# EAGLE design clock_schematic (EAGLE 7.7.0)
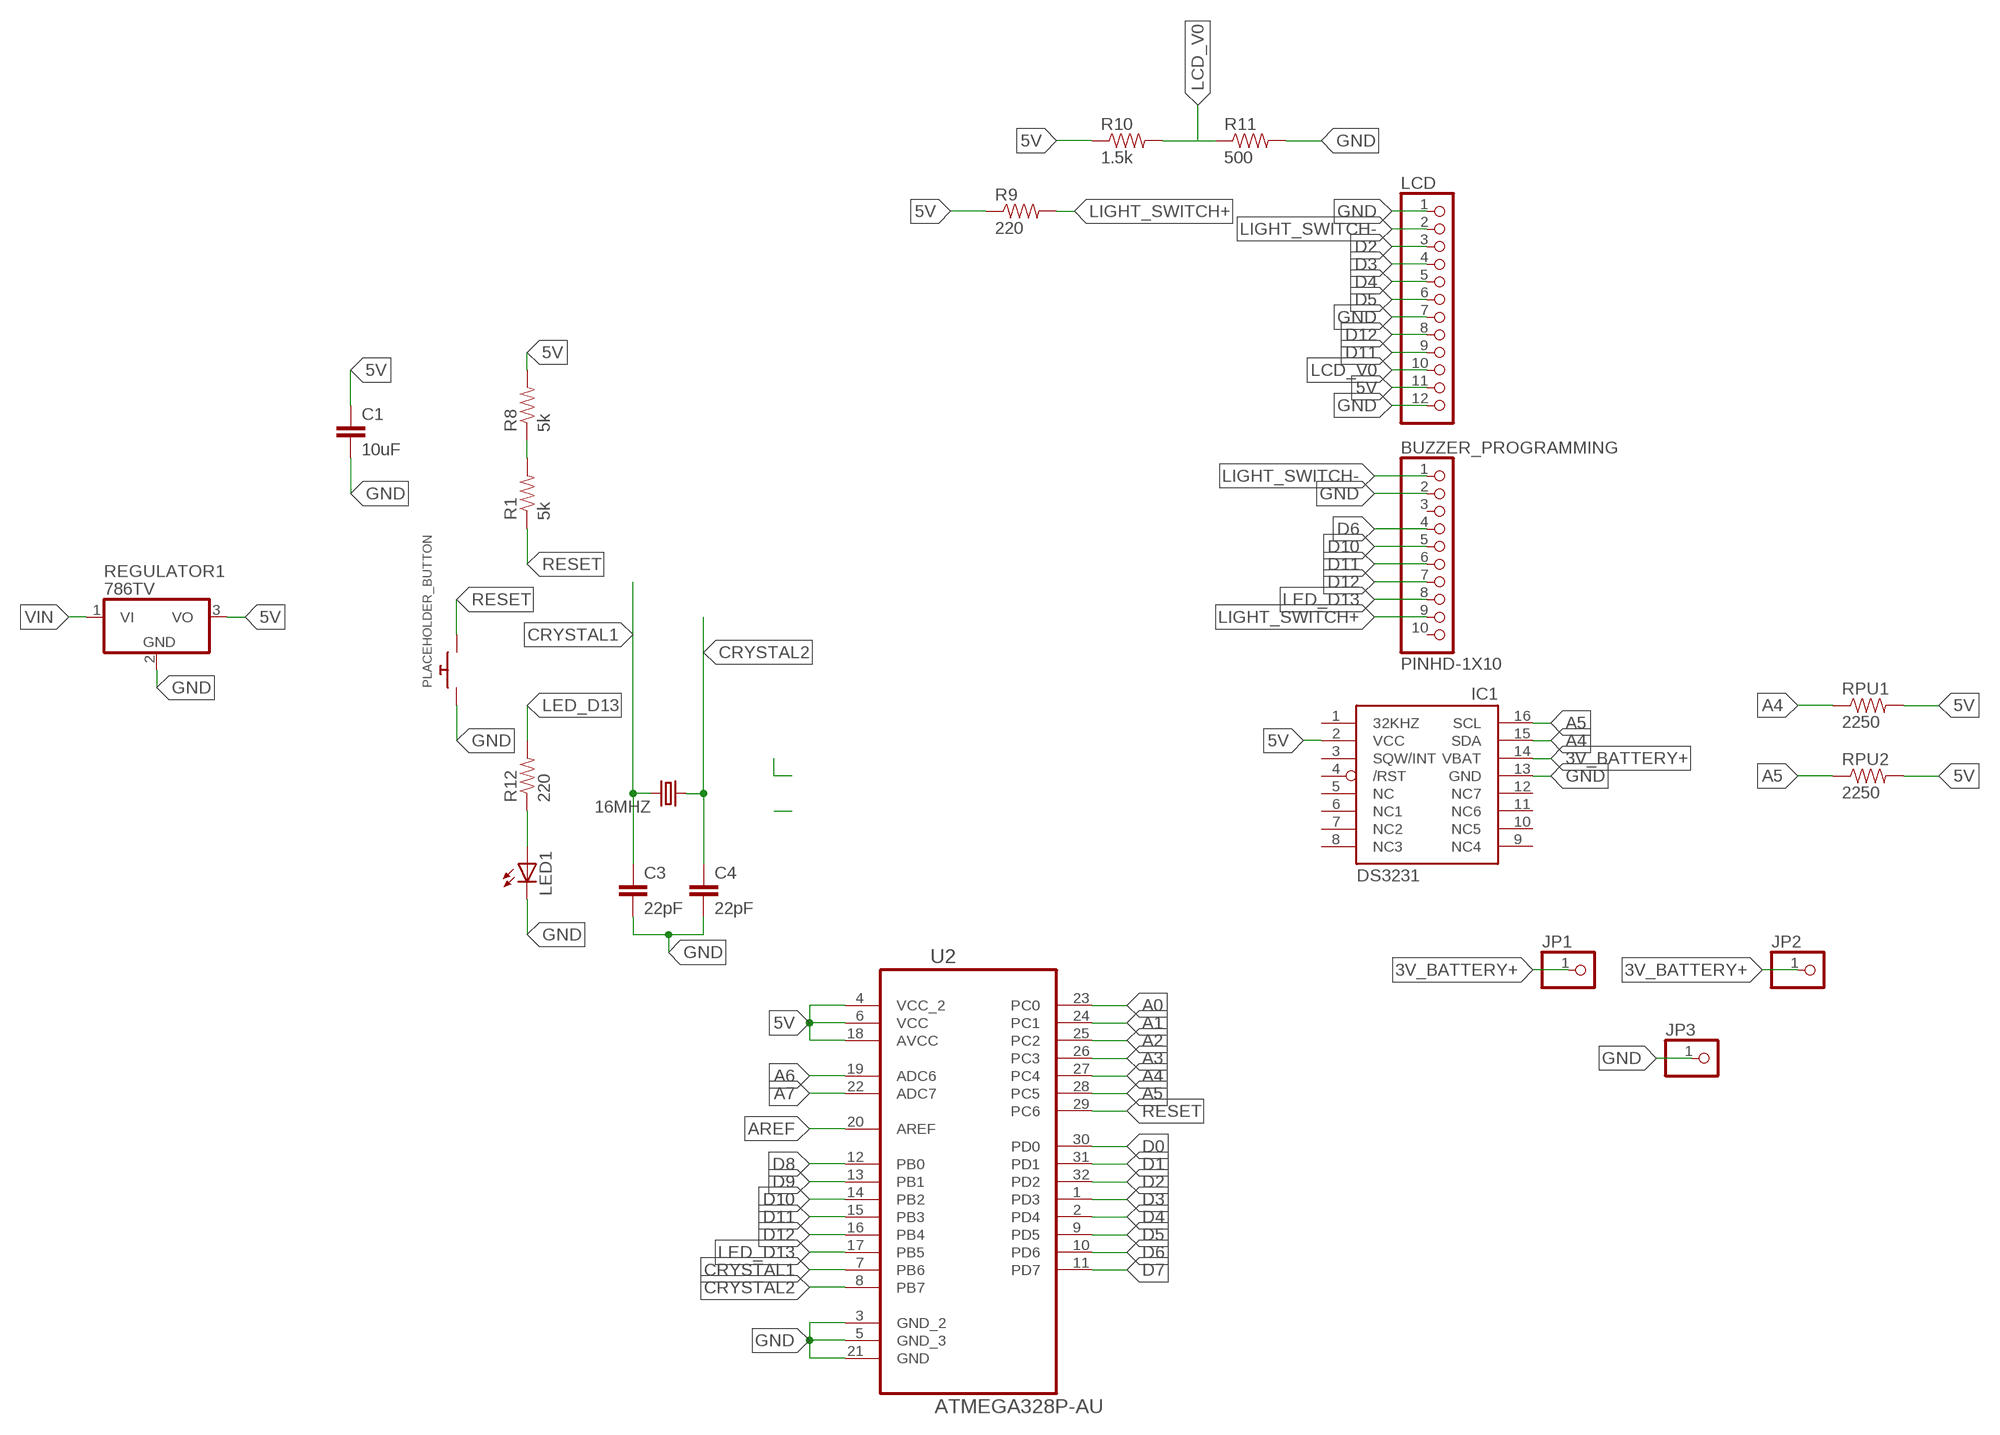
[diagram p0: schematic, sheet 1]

## Parts
16MHZ  CRYSTALHC18U-V  [HC18U-V]
BUZZER_PROGRAMMING  PINHD-1X10  [1X10-BIG]
C1  10uF  CAP0805  [0805]
C3  22pF  CAP0805  [0805]
C4  22pF  CAP0805  [0805]
IC1  DS3231/SO  [SO16W]
JP1  PINHD-1X1  [1X01]
JP2  PINHD-1X1  [1X01]
JP3  PINHD-1X1  [1X01]
LCD  PINHD-1X12  [1X12]
LED1  LEDCHIPLED_0805  [CHIPLED_0805]
PLACEHOLDER_BUTTON  SWITCH_PUSHBUTTONSOFTTOUCHSMD_SJ  [PUSHBUTTON_SMD_SJ]
R1  5k  RESISTOR0805-RES  [0805]
R8  5k  RESISTOR0805-RES  [0805]
R9  220  RESISTOR0805-RES  [0805]
R10  1.5k  RESISTOR0805-RES  [0805]
R11  500  RESISTOR0805-RES  [0805]
R12  220  RESISTOR0805-RES  [0805]
REGULATOR1  786TV  [TO220V]
RPU1  2250  RESISTOR0805-RES  [0805]
RPU2  2250  RESISTOR0805-RES  [0805]
U2  ATMEGA328P-AU  [QFP80P900X900X120-32N]

## Nets
3V_BATTERY+: IC1.14(VBAT) JP1.1 JP2.1
5V: C1.1 IC1.2(VCC) LCD.11 R8.2 R9.1 R10.1 REGULATOR1.3(VO) RPU1.2 RPU2.2 U2.4(VCC_2) U2.6(VCC) U2.18(AVCC)
A0: U2.23(PC0)
A1: U2.24(PC1)
A2: U2.25(PC2)
A3: U2.26(PC3)
A4: IC1.15(SDA) RPU1.1 U2.27(PC4)
A5: IC1.16(SCL) RPU2.1 U2.28(PC5)
A6: U2.19(ADC6)
A7: U2.22(ADC7)
AREF: U2.20(AREF)
CRYSTAL1: 16MHZ.2 C3.1 U2.7(PB6)
CRYSTAL2: 16MHZ.1 C4.1 U2.8(PB7)
D0: U2.30(PD0)
D1: U2.31(PD1)
D2: LCD.3 U2.32(PD2)
D3: LCD.4 U2.1(PD3)
D4: LCD.5 U2.2(PD4)
D5: LCD.6 U2.9(PD5)
D6: BUZZER_PROGRAMMING.4 U2.10(PD6)
D7: U2.11(PD7)
D8: U2.12(PB0)
D9: U2.13(PB1)
D10: BUZZER_PROGRAMMING.5 U2.14(PB2)
D11: BUZZER_PROGRAMMING.6 LCD.9 U2.15(PB3)
D12: BUZZER_PROGRAMMING.7 LCD.8 U2.16(PB4)
GND: BUZZER_PROGRAMMING.2 C1.2 C3.2 C4.2 IC1.13(GND) JP3.1 LCD.1 LCD.7 LCD.12 LED1.C PLACEHOLDER_BUTTON.P$1 R11.2 REGULATOR1.2(GND) U2.3(GND_2) U2.5(GND_3) U2.21(GND)
LCD_V0: LCD.10 R10.2 R11.1
LED_D13: BUZZER_PROGRAMMING.8 R12.2 U2.17(PB5)
LIGHT_SWITCH+: BUZZER_PROGRAMMING.9 R9.2
LIGHT_SWITCH-: BUZZER_PROGRAMMING.1 LCD.2
N$3: R1.2 R8.1
N$4: LED1.A R12.1
RESET: PLACEHOLDER_BUTTON.P$2 R1.1 U2.29(PC6)
VIN: REGULATOR1.1(VI)
Unconnected: BUZZER_PROGRAMMING.3 BUZZER_PROGRAMMING.10 IC1.1(32KHZ) IC1.3(SQW/INT) IC1.4(/RST) IC1.5(NC) IC1.6(NC1) IC1.7(NC2) IC1.8(NC3) IC1.9(NC4) IC1.10(NC5) IC1.11(NC6) IC1.12(NC7)

## Library data of the parts
16MHZ = adafruit:CRYSTAL: CRYSTAL; OC_FARNELL: unknown; OC_NEWARK: unknown
BUZZER_PROGRAMMING = adafruit:PINHD-1X10: Pin header 1x10 0.1" spacing With round pins
C1 C3 C4 = SparkFun-Capacitors:CAP: Capacitor Standard 0603 ceramic capacitor, and 0.1" leaded capacitor.
IC1 = adafruit:DS3231
JP1-JP3 = adafruit:PINHD-1X1: Pin header 1x1 for 0.1" spacing With round pins
LCD = adafruit:PINHD-1X12: PIN HEADER
LED1 = adafruit:LED: LED OSRAM: - CHIPLED LG R971, LG N971, LY N971, LG Q971, LY Q971, LO R971, LY R971 LH N974, LH R974 LS Q976, LO Q976, LY Q976 LO Q996 - Hyper CHIPLED LW Q18S LB Q993, LB Q99A, LB R99A - SideLED LS A670, LO A670, LY A670, LG A670, LP A670 LB A673, LV A673, LT A673, LW A673 LH A674 LY A675 LS A676, LA A676, LO A676, LY A676, LW A676 LS A679, LY A679, LG A679 - Hyper Micro SIDELED® LS Y876, LA Y876, LO Y876, LY Y876 LT Y87S - SmartLED LW L88C, LW L88S LB L89C, LB L89S, LG L890 LS L89K, LO L89K, LY L89K LS L896, LA L896, LO L896, LY L896 - TOPLED LS T670, LO T670, LY T670, LG T670, LP T670 LSG T670, LSP T670, LSY T670, LOP T670, LYG T670 LG T671, LOG T671, LSG T671 LB T673, LV T673, LT T673, LW T673 LH T674 LS T676, LA T676, LO T676, LY T676, LB T676, LH T676, LSB T676, LW T676 LB T67C, LV T67C, LT T67C, LS T67K, LO T67K, LY T67K, LW E67C LS E67B, LA E67B, LO E67B, LY E67B, LB E67C, LV E67C, LT E67C LW T67C LS T679, LY T679, LG T679 LS T770, LO T770, LY T770, LG T770, LP T770 LB T773, LV T773, LT T773, LW T773 LH T774 LS E675, LA E675, LY E675, LS T675 LS T776, LA T776, LO T776, LY T776, LB T776 LHGB T686 LT T68C, LB T68C - Hyper Mini TOPLED® LB M676 - Mini TOPLED Santana® LG M470 LS M47K, LO M47K, LY M47K Source: http://www.osram.convergy.de/
PLACEHOLDER_BUTTON = adafruit:SWITCH_PUSHBUTTON: Buttons SOFTTOUCHSMD_SJ - Soft touch temporary push button (Super Junk Akihabara) Compatible with SKPMANE010 [Mouser: 688-SKPMAN] C&K_KSS = Digikey: KSS221GLFS
R1 R8-R12 RPU1 RPU2 = SparkFun-Resistors:RESISTOR: Resistor Basic schematic elements and footprints for 0603, 1206, and PTH resistors.
REGULATOR1 = linear:78*: Positive VOLTAGE REGULATOR Source: http://cache.national.com/ds/LM/LM78L05.pdf http://www.fairchildsemi.com/ds/LM/LM7805.pdf
U2 = Atmel_By_element14_Batch_1-00:ATMEGA328P-AU: 8-bit Microcontroller with In-System Programmable Flash; MPN: ATMEGA328P-AU; OC_FARNELL: 1715486; OC_NEWARK: 14R4631; PACKAGE: TQFP-32; SUPPLIER: Atmel

## Board
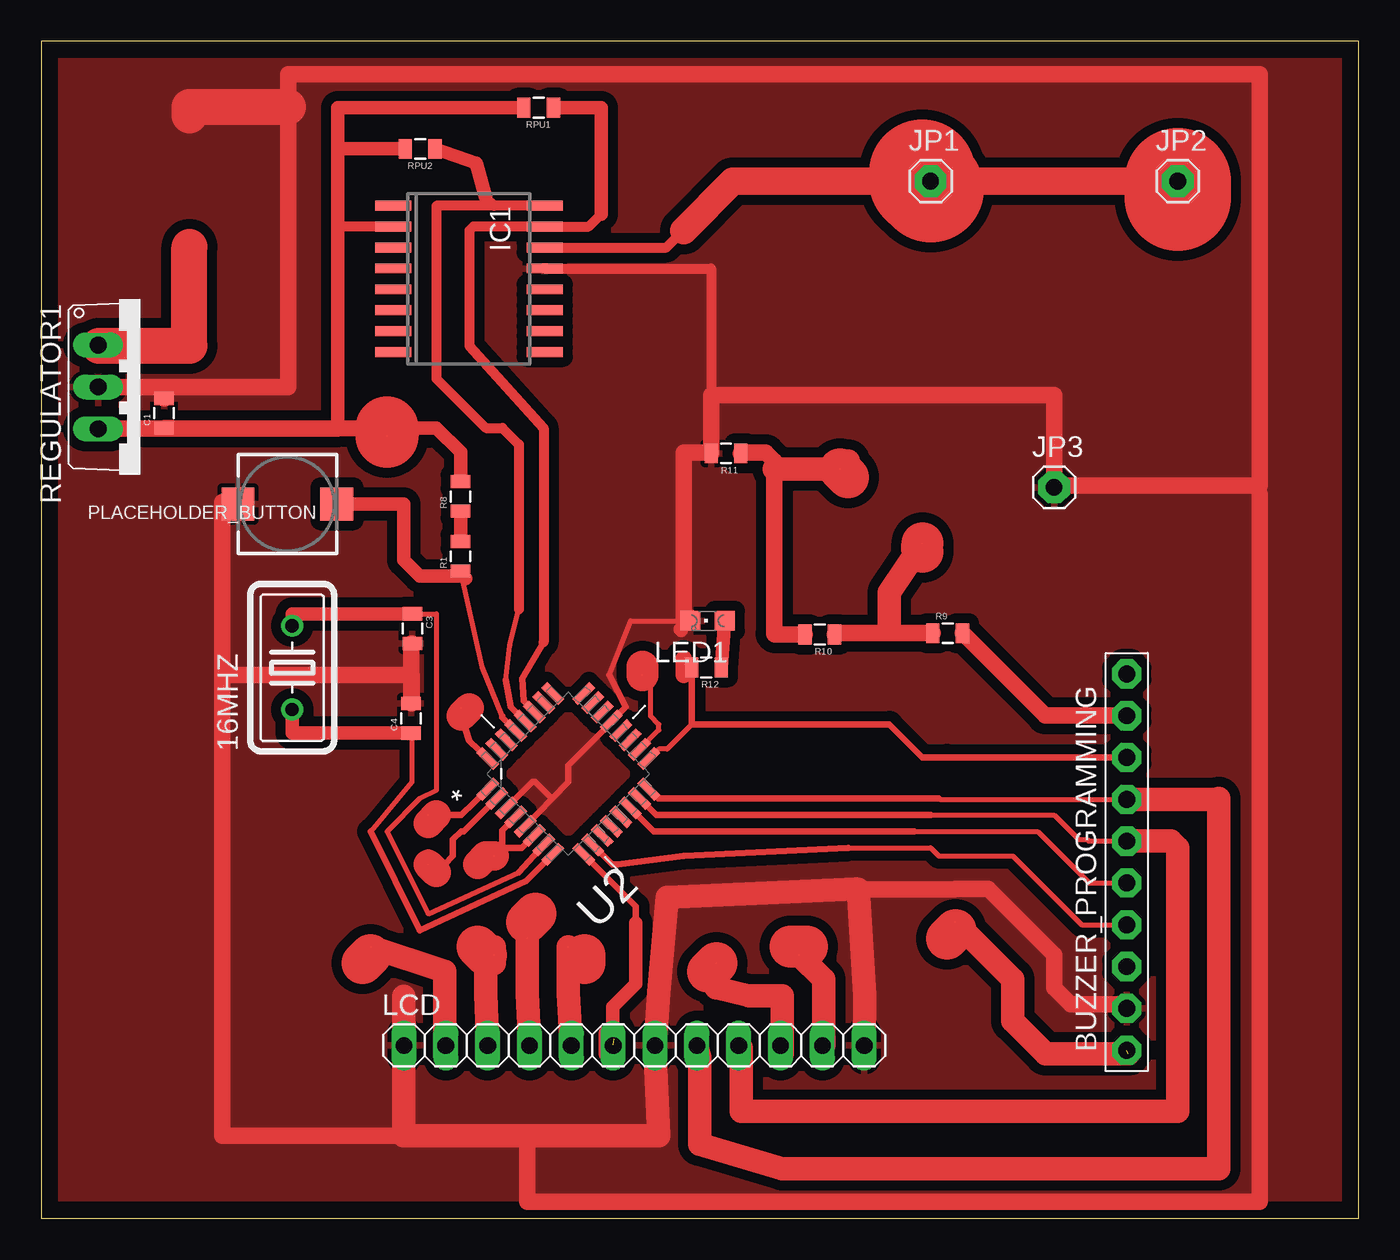
[diagram p1: board, top side]
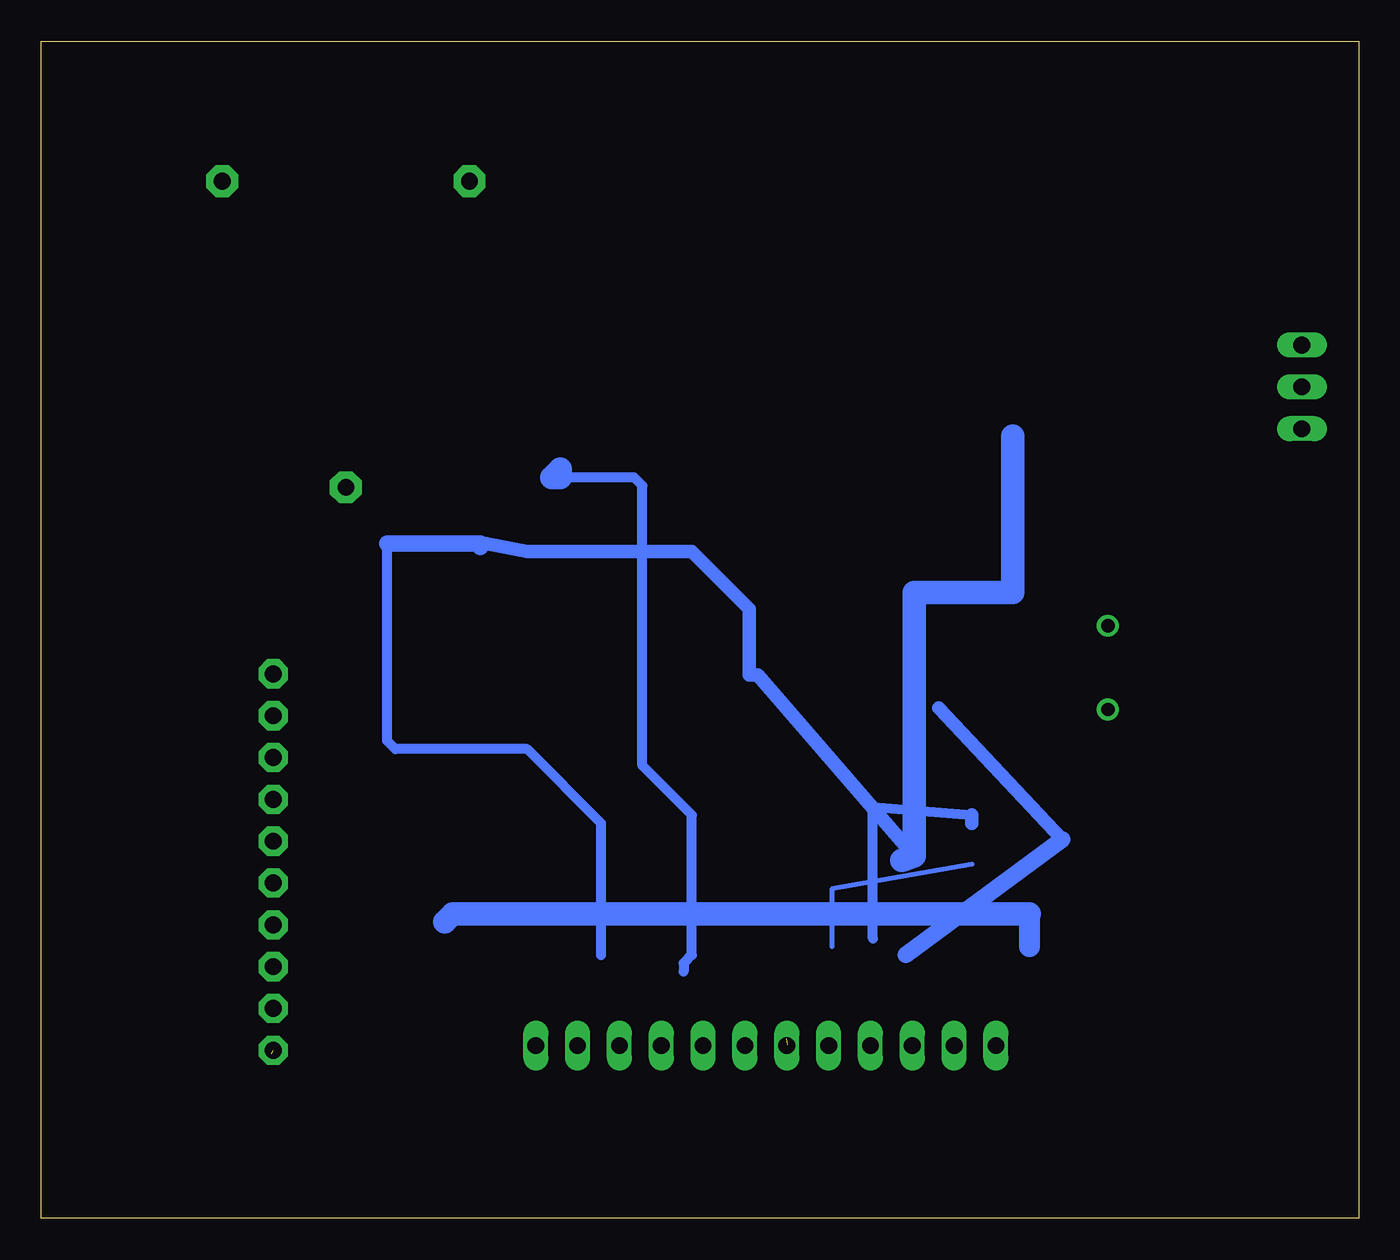
[diagram p2: board, bottom side, seen from below]

Size 80 x 71.5 mm. Coordinates in mm from the lower left corner, seen from the top.
Outline: 0,0 80,0 80,71.5 0,71.5 0,0
Copper layers (1*16): Top 0.035mm / dielectric 1.5mm / Bottom 0.035mm
Design rules "default": minimum track width 10mil, minimum drill 24mil, track to track 8mil, track to pad 8mil, pad to pad 8mil, via to via 8mil, smd to smd 8mil, copper to edge 40mil, drill to drill 8mil, minimum pad ring 10mil, minimum via ring 8mil, stop-mask expansion 4mil, vias tented up to drill 0mil, thermal gap 10mil

### Footprints (pad centres in the part's own frame; a part is rotated, then mirrored left to right if it is on the bottom)
HC18U-V = drill 0.813: 1 -2.54,0; 2 2.54,0
1X10-BIG = drill 1.016 pad 1.778 octagon: 1 -11.43,0; 2 -8.89,0; 3 -6.35,0; 4 -3.81,0; 5 -1.27,0; 6 1.27,0; 7 3.81,0; 8 6.35,0; 9 8.89,0; 10 11.43,0
0805 = smd 0.8 x 1.2: 1 -0.9,0; 2 0.9,0
SO16W = smd 0.6 x 2.2: 1 -4.445,-4.6; 2 -3.175,-4.6; 3 -1.905,-4.6; 4 -0.635,-4.6; 5 0.635,-4.6; 6 1.905,-4.6; 7 3.175,-4.6; 8 4.445,-4.6; 9 4.445,4.6; 10 3.175,4.6; 11 1.905,4.6; 12 0.635,4.6; 13 -0.635,4.6; 14 -1.905,4.6; 15 -3.175,4.6; 16 -4.445,4.6
1X01 = drill 1.016 pad 1.93 octagon: 1 0,0
1X12 = drill 1.016 long: 1 -13.97,0; 2 -11.43,0; 3 -8.89,0; 4 -6.35,0; 5 -3.81,0; 6 -1.27,0; 7 1.27,0; 8 3.81,0; 9 6.35,0; 10 8.89,0; 11 11.43,0; 12 13.97,0
CHIPLED_0805 = smd 1.2 x 1.2: A 0,-1.05; C 0,1.05
PUSHBUTTON_SMD_SJ = smd 2 x 2: P$1 3,0; P$2 -3,0
TO220V = drill 1.016 long: 1 -2.54,-2.54; 2 0,-2.54; 3 2.54,-2.54
QFP80P900X900X120-32N = smd 1.473 x 0.508: 1 -4.115,2.794; 2 -4.115,2.007; 3 -4.115,1.194; 4 -4.115,0.406; 5 -4.115,-0.406; 6 -4.115,-1.194; 7 -4.115,-2.007; 8 -4.115,-2.794; 17 4.115,-2.794; 18 4.115,-2.007; 19 4.115,-1.194; 20 4.115,-0.406; 21 4.115,0.406; 22 4.115,1.194; 23 4.115,2.007; 24 4.115,2.794 | smd 0.508 x 1.473: 9 -2.794,-4.115; 10 -2.007,-4.115; 11 -1.194,-4.115; 12 -0.406,-4.115; 13 0.406,-4.115; 14 1.194,-4.115; 15 2.007,-4.115; 16 2.794,-4.115; 25 2.794,4.115; 26 2.007,4.115; 27 1.194,4.115; 28 0.406,4.115; 29 -0.406,4.115; 30 -1.194,4.115; 31 -2.007,4.115; 32 -2.794,4.115

### Placement (x,y rotation side)
16MHZ  15.24,33.45 90 top
BUZZER_PROGRAMMING  65.91,21.64 90 top
C1  7.46,48.9 90 top
C3  22.54,35.82 270 top
C4  22.46,30.37 90 top
IC1  25.97,57.06 270 top
JP1  54,63 0 top
JP2  69,63 0 top
JP3  61.5,44.4 0 top
LCD  36,10.5 0 top
LED1  40.46,36.29 90 top
PLACEHOLDER_BUTTON  14.95,43.39 180 top
R1  25.46,40.21 90 top
R8  25.46,43.85 90 top
R9  55.04,35.54 0 top
R10  47.27,35.46 180 top
R11  41.58,46.46 180 top
R12  40.39,33.46 180 top
REGULATOR1  6,50.5 270 top
RPU1  30.2,67.46 180 top
RPU2  23.01,64.96 180 top
U2  32,27 45 top

### Tracks (layer width: path | path; a pad name or v marks a point on that pad's centre or on a via)
3V_BATTERY+
  Top 0.61: IC1.14 37.97,58.97 39,60
  Top 1.676: JP2.1 JP1.1 42,63 39,60
  Top 6.452: JP2.1 69,62
5V  (5 unrouted)
  Top 0.305: U2.18 37.5,29.66 37.5,30 37,30.5 37,33 36.5,33
  Top 0.406: 47.5,10.5 LCD.11 | U2.4 28,23.57 28,22.5 | U2.6 29.19,22.5 28,22.5 | 28,22.5 27.5,22 27,21.5
  Top 0.61: IC1.2 18.23,60.23 18,60
  Top 0.813: R8.2 25.46,46.54 24,48 21,48 18,48 18,60 18,64.96 | RPU1.2 18,67.46 18,64.96 | RPU2.2 18,64.96 | 27,21.5 27,22
  Top 1.016: R10.1 48.25,35.54 R9.1 51.96,35.54 51.5,36 | REGULATOR1.3 8,47.96 | 8,47.96 12,47.96 | 12,47.96 21,48 | C1.1 8,48 8,47.96 | 12,47.96 18,47.96 18,48
  Top 1.422: 47.5,10.5 47.5,14.5 46,16 | 53.5,41 51.5,38 51.5,36
  Top 1.778: 27.5,22 27,22 26.5,21.5
  Top 1.93: 36.5,33.5 36.5,33
  Top 2.54: 53.5,40.5 53.5,41
  Top 3.81: 21,48 21,47.5
  Bottom 0.61: 46,16 46,24 50.5,28.5 58.5,28.5 59,29 59,41
  Bottom 0.813: 27,22 36.5,33 37,33 37,37 40.5,40.5 50.5,40.5 53,41 53.5,41 | 27.75,21.75 27.5,22
  Bottom 1.016: 59,41 53.5,41 53.35,41 53.35,40.77
  Bottom 1.422: 21,47.5 21,38 27,38 27,22 27.75,21.75
A4
  Top 0.406: 30.5,35 29.2,32.8 29.3,31.44 U2.27
  Top 0.61: 34,61 33.23,60.23 IC1.15 26.23,60.23 26,60 26,53 30.5,48 30.5,35
  Top 0.813: RPU1.1 34,67.46 34,61
A5
  Top 0.305: 28.2,32.7 28.45,34.8 29,37
  Top 0.406: U2.28 28.5,31.08 28.2,32.7
  Top 0.61: 27,62 27.49,61.5 IC1.16 24,61.5 24,51 27,48 28,48 29,47 29,37
  Top 0.813: RPU2.1 26.41,64.09 27,62
CRYSTAL1
  Top 0.305: C3.1 24,36.72 24,26 23,25.5 21,23.5 23.5,18.5 29,21
  Top 0.406: U2.7 29,21
  Top 0.813: C3.1 15.24,36.72 16MHZ.2
CRYSTAL2
  Top 0.305: C4.1 22.5,29.5 22.5,26.5 20,23.5
  Top 0.406: U2.8 29.45,20.5 23,17.5 20,23.5
  Top 0.813: C4.1 15.24,29.47 16MHZ.1
D2  (2 unrouted)
  Top 0.406: U2.32 26,29 25.5,30.5
  Top 0.813: 25.5,30.5 25.5,31
  Top 1.422: LCD.3 27,13.61 27,15.5 27.5,16
  Top 1.778: 25.5,30.5 26,31
  Bottom 0.813: 18,23 25.5,31
  Bottom 1.016: 18,23 27.5,16
D3  (2 unrouted)
  Top 0.406: U2.1 25.5,24.5 24,24.5 23.5,24.5
  Top 0.813: 23.5,24.5 23.5,24
  Top 1.422: LCD.4 29.5,13.65 29.5,17
  Top 1.778: 23.5,24 24,24.5
  Bottom 0.61: 29.5,17 29.5,25 23.5,24.5
  Bottom 0.813: 23.5,24.5 23.5,24
D4  (2 unrouted)
  Top 0.406: U2.2 25.66,23.5 25.5,23.5 25,23 25,22 24.5,21.5 24,21.5
  Top 0.813: 23.5,22 23.5,21.5 24,21.5
  Top 1.422: LCD.5 32,13.69 32,16.5
  Top 1.778: 23.5,21.5 24,21
  Bottom 0.305: 23.5,21.5 32,20 32,16.5
D5  (1 unrouted)
  Top 0.406: U2.9 36.1,18.95 36.1,17.95
  Top 0.813: 36.1,17.95 36.1,14.25 34.7,12.85 34.7,10.53 LCD.6
  Top 1.016: 34.55,10.9 34.75,10.9 34.75,9.95 34.95,9.95 34.95,11.25 34.35,11.25 34.35,10
D6
  Top 0.305: 49,22.5 54,22.5 54.5,22 59,22 63.17,17.83 BUZZER_PROGRAMMING.4
  Top 0.406: U2.10 34.66,21.5 35,21.5 39,22 49,22.5
D10
  Top 0.305: 53,23.5 60.5,23.5 63.63,20.37 BUZZER_PROGRAMMING.5
  Top 0.406: U2.14 37.19,23.5 53,23.5
D11
  Top 0.305: 54,24.5 61.5,24.5 63,23 63.5,23 63.59,22.91 BUZZER_PROGRAMMING.6
  Top 0.406: U2.15 37.34,24.5 54,24.5 | LCD.9 42.5,10.35
  Top 1.422: 42.5,10.35 42.5,6.5 69,6.5 69,22.5 68.59,22.91 BUZZER_PROGRAMMING.6
D12
  Top 0.305: 54.5,25.5 54.55,25.45 BUZZER_PROGRAMMING.7
  Top 0.406: U2.16 37.45,25.5 54.5,25.5
  Top 1.422: LCD.8 40,9.81 40,4.5 45,3 71.5,3 71.5,25.5 71.45,25.45 BUZZER_PROGRAMMING.7
GND
  Top 0.305: 34.5,33 35.79,36.29 LED1.C
  Top 0.406: U2.5 31.02,25.49 | 31.02,25.49 32,26.5 32,27.5 34.62,30.12 U2.21 35.5,31.08 34.5,33 | U2.3 29.81,26.5 30,26.5 31.01,25.49 31.02,25.49
  Top 0.61: IC1.13 40.68,57.69 40.68,50 | R11.2 40.54,46.46 40.5,46.5
  Top 0.813: 38.95,36.25 38.95,35.95 38.8,35.8 38.8,35.75 38.85,35.7
  Top 1.016: 61.5,44.5 JP3.1 61.5,44 | 61.5,44.5 61.5,50 40.68,50 R11.2 | 61.5,44.5 74,44.5 74,69.5 15,69.5 15,67.5 15,50.5 REGULATOR1.2 7.46,50.5 C1.2 | 40.5,46.5 39,46.5 39,36.5 39.41,36.5 LED1.C | BUZZER_PROGRAMMING.2 65.66,13 62.5,13 61.5,14 61.5,16 57.5,20 55.5,20 55.48,19.98 49.62,19.98 | C3.2 22.46,34.92 C4.2 22.5,31.27 22.5,33 11,33 | 74,44 74,1 29.5,1 29.5,5 | 11,33 11,5 22,5 | 11.5,43.5 11,43.5 11,43.39 | 11,43.39 11,33 | PLACEHOLDER_BUTTON.P$1 11,43.39
  Top 1.422: LCD.1 22,13.47 22,5 29.5,5 37.5,5 37.27,9.77 LCD.7 37.5,13.73 38,19.5 49.5,20 49.62,19.98 50,13.53 LCD.12
  Top 2.184: 15,67.5 9,67.5 9,67
  pour Top (isolate 0.61): 0,71.5 80,71.5 80,0 0,0
LCD_V0  (2 unrouted)
  Top 0.406: 45,13.5 44.89,13.39 LCD.10
  Top 1.016: R11.1 42.52,46.5 44,46.5 44.5,46 44.5,45.5 44.5,35.5 44.54,35.46 R10.2
  Top 1.422: 45,10 45,13.5 43,13.5 41,14 41,15.5 | 48.5,45.5 44.5,45.5 | 49,46 49,45
  Top 2.54: 40.5,15 41,15.5 | 48.5,45.5 49,45
  Bottom 0.61: 49,45.5 48.5,45 44,45 43.5,44.5 43.5,27.5 40.5,24.5 40.5,16 41,15.5 41,15
  Bottom 1.422: 48.5,45 49,45 48.5,45.5 48.5,45
LED_D13
  Top 0.305: 39.5,30 38,28.5 37.5,28.5 36.93,27.93 U2.17
  Top 0.406: R12.2 39.5,30 51.5,30 53.5,28 55,28 55.01,27.99 BUZZER_PROGRAMMING.8
LIGHT_SWITCH+
  Top 1.016: R9.2 60.95,30.53 BUZZER_PROGRAMMING.9
LIGHT_SWITCH-  (3 unrouted)
  Top 0.406: LCD.2 24.5,10.5
  Top 1.422: 66,10 61,10 59,12 59,14.5 55.5,18 | 24.5,10.5 24.5,15 20,16.5
  Bottom 1.27: 20,18.5 20,18 20,16.5
  Bottom 1.422: 20,18.5 55,18.5 55.5,18
N$2
  Top 2.54: 46.5,16.5 45.5,16.5
N$3
  Top 0.813: R1.2 R8.1
N$4
  Top 0.813: LED1.A R12.1
N$5
  Top 1.016: 39,34 39,33
N$6
  Top 2.184: 3.5,53 9,53 9,59
N$7
  Top 1.422: 27.5,15.5 27.5,16.5
N$8
  Top 1.422: 29.5,13.5 29.5,17.5
N$9
  Top 1.422: 32,16.5 32,13.5
N$10
  Top 2.54: 55.5,17.5 55,17
N$11
  Top 2.54: 33,15.5 33,16
N$12
  Top 2.54: 27,16 26.5,16.5
N$13
  Top 2.54: 30,18.5 29.5,18
N$14
  Top 2.54: 20,16 19.5,15.5
N$15
  Top 6.452: 53.5,63.5 53.5,63 54,62.5
RESET
  Top 0.305: 28,30.5 26.77,33.5 R1.1
  Top 0.406: U2.29 28,30.42 28,30.5
  Top 0.61: 25.62,39 25.62,39.15 R1.1
  Top 0.813: PLACEHOLDER_BUTTON.P$2 22,43.39 22,40 23,39 25.62,39 25.78,38.85